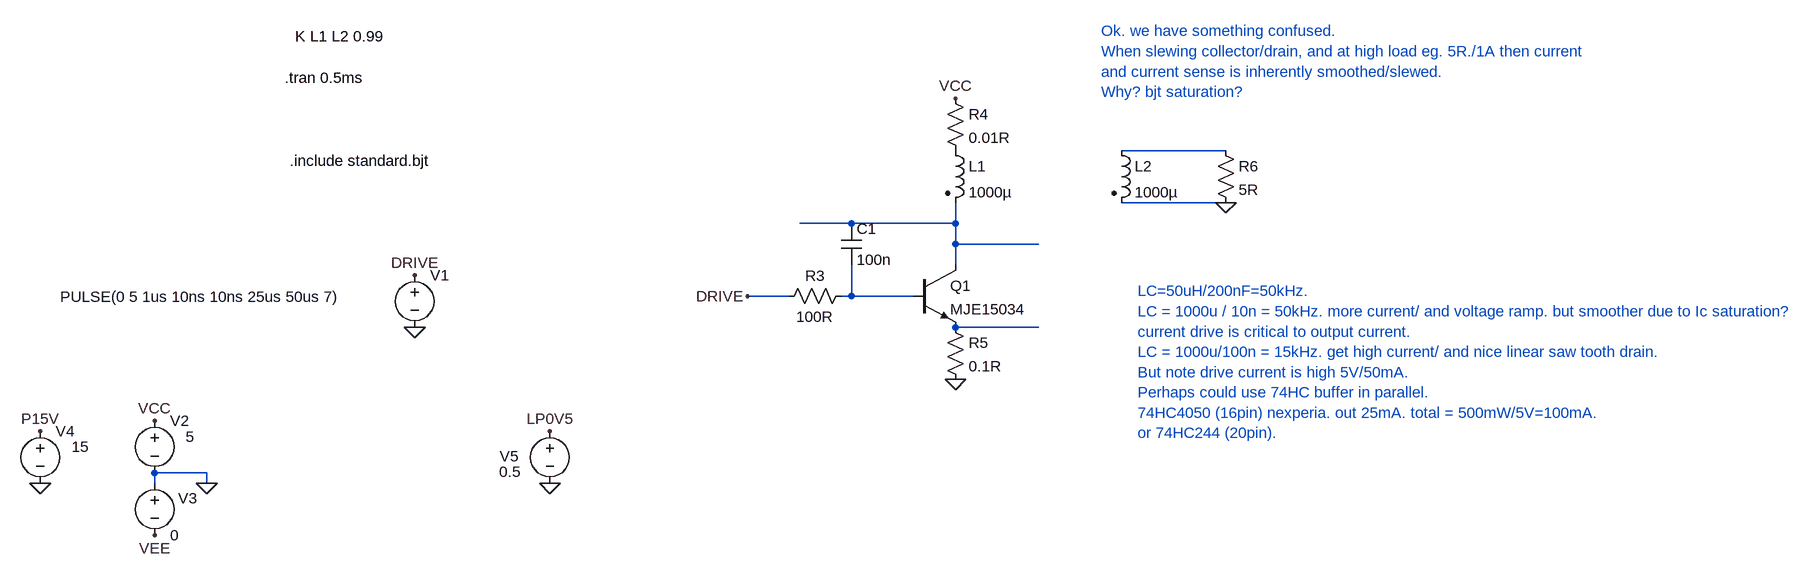
[diagram p0: schematic Draft71.asc]
Draft71.asc, the LTspice schematic file:
Version 4
SHEET 1 6648 1268
WIRE 1360 -112 1200 -112
WIRE 1360 -32 1200 -32
WIRE 784 0 704 0
WIRE 944 0 944 -32
WIRE 944 0 784 0
WIRE 944 32 944 0
WIRE 1072 32 944 32
WIRE 944 64 944 32
WIRE 688 112 624 112
WIRE 784 112 784 64
WIRE 784 112 768 112
WIRE 880 112 784 112
WIRE 1072 160 944 160
WIRE -208 384 -288 384
WIRE -288 400 -288 384
WIRE -208 400 -208 384
FLAG -208 400 0
FLAG -288 304 VCC
FLAG -288 480 VEE
FLAG -464 400 0
FLAG -464 320 P15V
FLAG 112 160 0
FLAG 944 -192 VCC
FLAG 944 240 0
FLAG 320 400 0
FLAG 320 320 LP0V5
FLAG 112 80 DRIVE
FLAG 624 112 DRIVE
FLAG 1360 -32 0
SYMBOL voltage -288 288 R0
WINDOW 123 0 0 Left 0
WINDOW 39 0 0 Left 0
WINDOW 3 48 40 Left 2
SYMATTR Value 5
SYMATTR InstName V2
SYMBOL voltage -288 384 R0
WINDOW 123 0 0 Left 0
WINDOW 39 0 0 Left 0
WINDOW 0 36 39 Left 2
SYMATTR InstName V3
SYMATTR Value 0
SYMBOL voltage -464 304 R0
WINDOW 123 0 0 Left 0
WINDOW 39 0 0 Left 0
WINDOW 3 48 40 Left 2
SYMATTR Value 15
SYMATTR InstName V4
SYMBOL voltage 112 64 R0
WINDOW 123 0 0 Left 0
WINDOW 39 0 0 Left 0
WINDOW 3 -545 49 Left 2
SYMATTR Value PULSE(0 5 1us 10ns 10ns 25us 50us 7)
SYMATTR InstName V1
SYMBOL npn 880 64 R0
SYMATTR InstName Q1
SYMATTR Value MJE15034
SYMBOL res 672 128 R270
WINDOW 0 32 56 VTop 2
WINDOW 3 0 56 VBottom 2
SYMATTR InstName R3
SYMATTR Value 100R
SYMBOL res 928 -208 R0
SYMATTR InstName R4
SYMATTR Value 0.01R
SYMBOL res 928 144 R0
SYMATTR InstName R5
SYMATTR Value 0.1R
SYMBOL ind2 928 -128 R0
SYMATTR InstName L1
SYMATTR Value 1000µ
SYMATTR Type ind
SYMBOL ind2 1184 -128 R0
SYMATTR InstName L2
SYMATTR Value 1000µ
SYMATTR Type ind
SYMBOL res 1344 -128 R0
SYMATTR InstName R6
SYMATTR Value 5R
SYMBOL voltage 320 304 R0
WINDOW 123 0 0 Left 0
WINDOW 39 0 0 Left 0
WINDOW 3 -78 78 Left 2
WINDOW 0 -77 54 Left 2
SYMATTR Value 0.5
SYMATTR InstName V5
SYMBOL cap 768 0 R0
SYMATTR InstName C1
SYMATTR Value 100n
TEXT -88 -224 Left 2 !.tran 0.5ms
TEXT -72 -288 Left 2 !K L1 L2 0.99
TEXT 1168 -296 Left 2 ;Ok. we have something confused. \nWhen slewing collector/drain, and at high load eg. 5R./1A then current\nand current sense is inherently smoothed/slewed. \nWhy? bjt saturation?
TEXT -80 -96 Left 2 !.include standard.bjt
TEXT 1224 104 Left 2 ;LC=50uH/200nF=50kHz.\nLC = 1000u / 10n = 50kHz. more current/ and voltage ramp. but smoother due to Ic saturation?\ncurrent drive is critical to output current.\nLC = 1000u/100n = 15kHz. get high current/ and nice linear saw tooth drain.\nBut note drive current is high 5V/50mA.\nPerhaps could use 74HC buffer in parallel.\n74HC4050 (16pin) nexperia. out 25mA. total = 500mW/5V=100mA.\nor 74HC244 (20pin).

The netlist it stands for:
* Draft71.asc
V2 VCC 0 5
V3 0 VEE 0
V4 P15V 0 15
V1 DRIVE 0 PULSE(0 5 1us 10ns 10ns 25us 50us 7)
Q1 N002 N003 N004 0 MJE15034
R3 DRIVE N003 100R
R4 VCC P001 0.01R
R5 N004 0 0.1R
L1 P001 N002 1000µ
L2 N001 0 1000µ
R6 N001 0 5R
V5 LP0V5 0 0.5
C1 N002 N003 100n
.model NPN NPN
.model PNP PNP
.lib standard.bjt
.tran 0.5ms
K L1 L2 0.99
* Ok. we have something confused.
* When slewing collector/drain, and at high load eg. 5R./1A then current
* and current sense is inherently smoothed/slewed.
* Why? bjt saturation?
.include standard.bjt
* LC=50uH/200nF=50kHz.
* LC = 1000u / 10n = 50kHz. more current/ and voltage ramp. but smoother due to Ic saturation?
* current drive is critical to output current.
* LC = 1000u/100n = 15kHz. get high current/ and nice linear saw tooth drain.
* But note drive current is high 5V/50mA.
* Perhaps could use 74HC buffer in parallel.
* 74HC4050 (16pin) nexperia. out 25mA. total = 500mW/5V=100mA.
* or 74HC244 (20pin).
.backanno
.end